# EAGLE design RJ12Breakout4 (EAGLE 6.2)
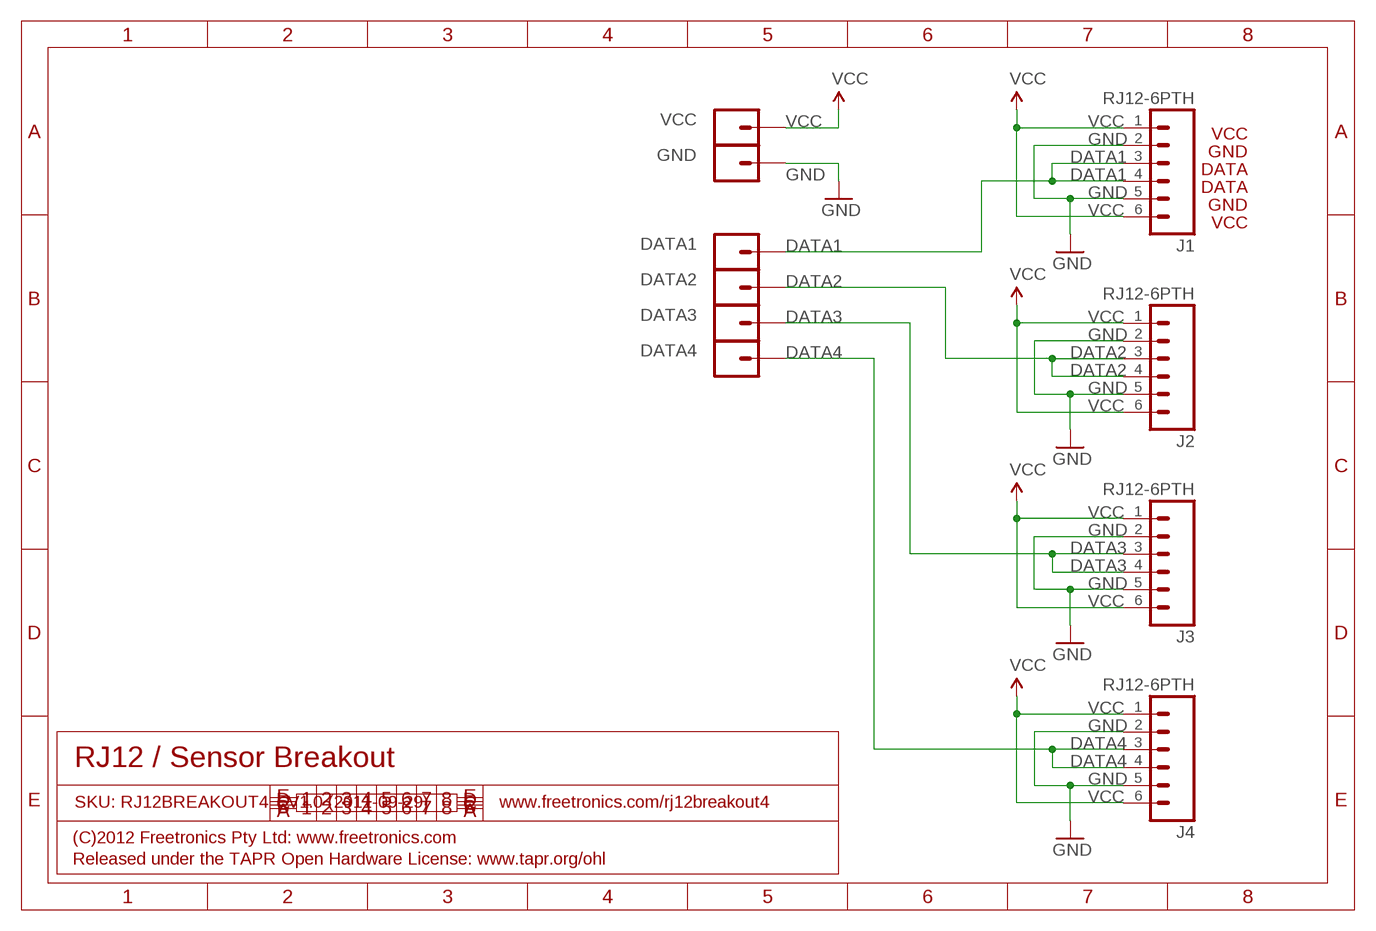
[diagram p0: schematic, sheet 1]

## Parts
DATA1  M01PTH  [1X01]
DATA2  M01PTH  [1X01]
DATA3  M01PTH  [1X01]
DATA4  M01PTH  [1X01]
GND  M01PTH  [1X01]
J1  RJ12-6PTH  [RJ12-6]
J2  RJ12-6PTH  [RJ12-6]
J3  RJ12-6PTH  [RJ12-6]
J4  RJ12-6PTH  [RJ12-6]
VCC  M01PTH  [1X01]

## Nets
DATA1: DATA1.1 J1.3 J1.4
DATA2: DATA2.1 J2.3 J2.4
DATA3: DATA3.1 J3.3 J3.4
DATA4: DATA4.1 J4.3 J4.4
GND: GND.1 J1.2 J1.5 J2.2 J2.5 J3.2 J3.5 J4.2 J4.5
VCC: J1.1 J1.6 J2.1 J2.6 J3.1 J3.6 J4.1 J4.6 VCC.1

## Notes on the sheet
- VCC
- GND
- DATA
- DATA
- GND
- VCC
- RJ12 / Sensor Breakout
- SKU: RJ12BREAKOUT4 | V1.0 (2011-09-29) | www.freetronics.com/rj12breakout4
- (C)2012 Freetronics Pty Ltd: www.freetronics.com
- Released under the TAPR Open Hardware License: www.tapr.org/ohl

## Library data of the parts
DATA1-DATA4 GND VCC = freetronics-master-v1:M01: Header 1 Standard 1-pin 0.1" header. Use with straight break away headers (SKU : PRT-00116), right angle break away headers (PRT-00553), swiss pins (PRT-00743), machine pins (PRT-00117), and female headers (PRT-00115).
J1-J4 = freetronics-jon:RJ12-6

## Board
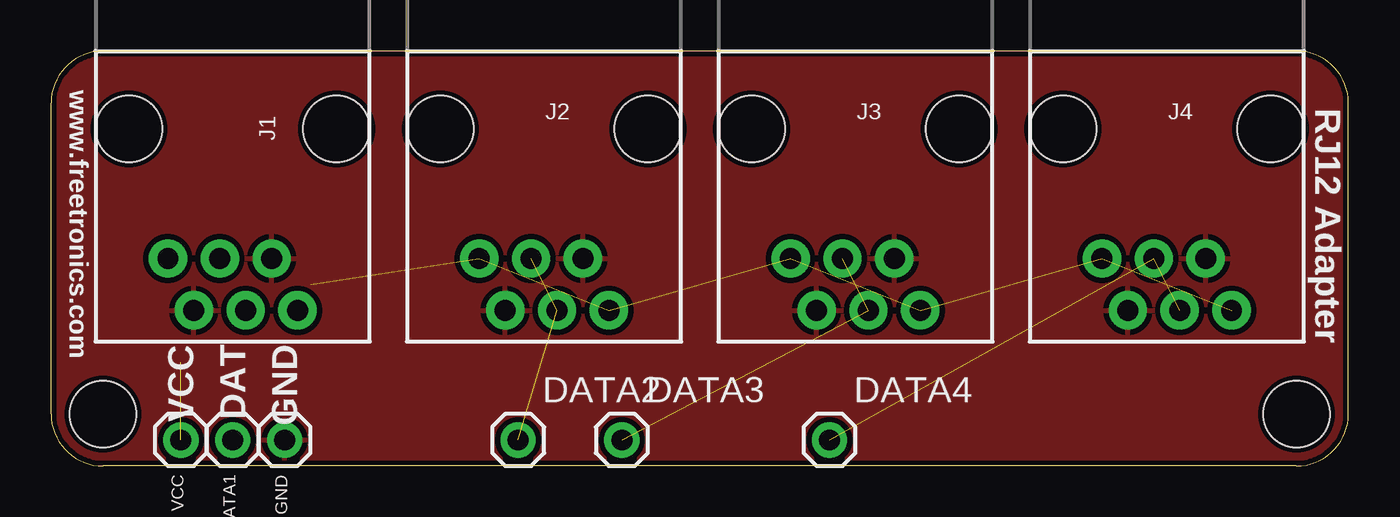
[diagram p1: board, top side]
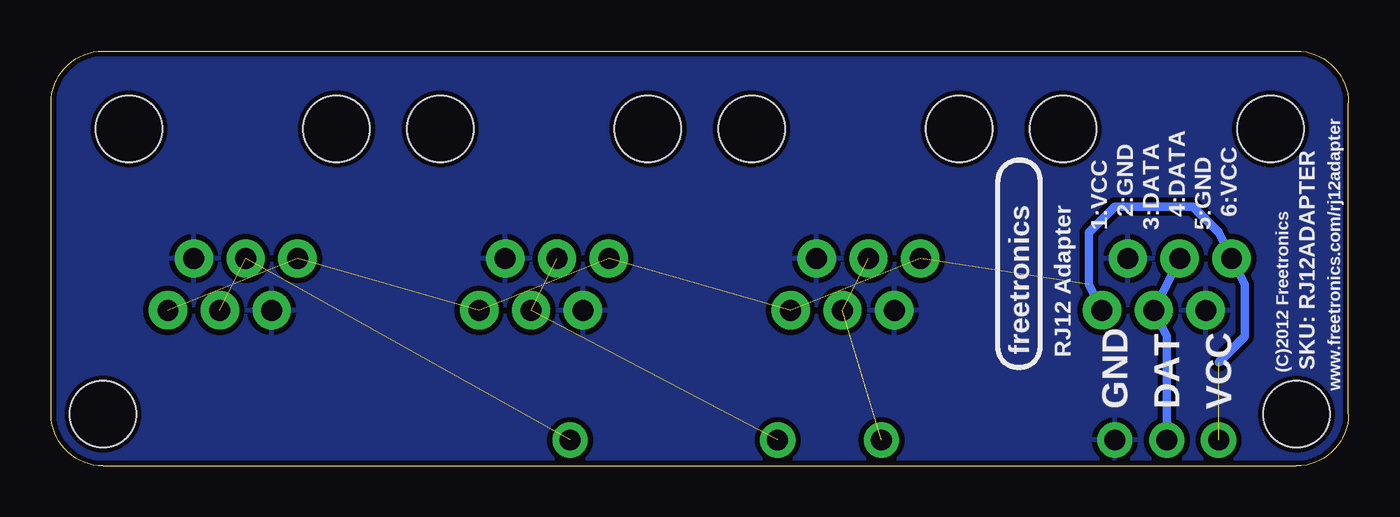
[diagram p2: board, bottom side, seen from below]

Size 63.5 x 20.32 mm. Coordinates in mm from the lower left corner, seen from the top.
Outline: 63.5,17.78 arc90 60.96,20.32 2.54,20.32 arc90 0,17.78 0,2.54 arc90 2.54,0 60.96,0 arc90 63.5,2.54 63.5,17.78
Copper layers (1*16): Top 0.035mm / dielectric 1.5mm / Bottom 0.035mm
Design rules: minimum track width 8mil, minimum drill 15mil, track to track 10mil, track to pad 10mil, pad to pad 10mil, via to via 10mil, smd to smd 8mil, copper to edge 10mil, drill to drill 8mil, minimum pad ring 14mil, minimum via ring 8mil, stop-mask expansion 4mil, vias tented up to drill 25mil, thermal gap 10mil
Holes 3.25 mm at 60.96,2.54 2.54,2.54

### Footprints (pad centres in the part's own frame; a part is rotated, then mirrored left to right if it is on the bottom)
1X01 = drill 1.016: 1 0,0
RJ12-6 = drill 1.016 pad 1.88: 1 -3.175,8.89; 2 -1.905,6.35; 3 -0.635,8.89; 4 0.635,6.35; 5 1.905,8.89; 6 3.175,6.35 | hole 3.251: -5.08,0; 5.08,0

### Placement (x,y rotation side)
DATA1  8.89,1.27 180 top
DATA2  22.86,1.27 0 top
DATA3  27.94,1.27 0 top
DATA4  38.1,1.27 0 top
GND  11.43,1.27 180 top
J1  8.89,16.51 180 top
J2  24.13,16.51 180 top
J3  39.37,16.51 180 top
J4  54.61,16.51 180 top
VCC  6.35,1.27 180 top

### Tracks (layer width: path | path; a pad name or v marks a point on that pad's centre or on a via)
DATA1
  Bottom 0.406: J1.4 J1.3 8.89,6.35 DATA1.1
DATA2  (2 unrouted)
DATA3  (2 unrouted)
DATA4  (2 unrouted)
GND
  pour Bottom: 60.96,0 arc90 63.5,2.54 63.5,17.78 arc90 60.96,20.32 2.54,20.32 arc90 0,17.78 0,2.54 arc90 2.54,0
  pour Top: 63.5,2.54 63.5,17.78 arc90 60.96,20.32 2.54,20.32 arc90 0,17.78 0,2.54 arc90 2.54,0 60.96,0 arc90
VCC  (7 unrouted)
  Bottom 0.406: J1.1 12.7,8.89 12.7,11.43 11.43,12.7 7.62,12.7 6.35,11.43 J1.6 5.08,8.89 5.08,6.35 6.35,5.08

### Text on the board
tPlace: www.freetronics.com | RJ12 Adapter | VCC | DAT | GND
bPlace: 6:VCC | 5:GND | 4:DATA | 3:DATA | 2:GND | 1:VCC | SKU: RJ12ADAPTER | (C)2012 Freetronics | RJ12 Adapter | freetronics | www.freetronics.com/rj12adapter | VCC | DAT | GND